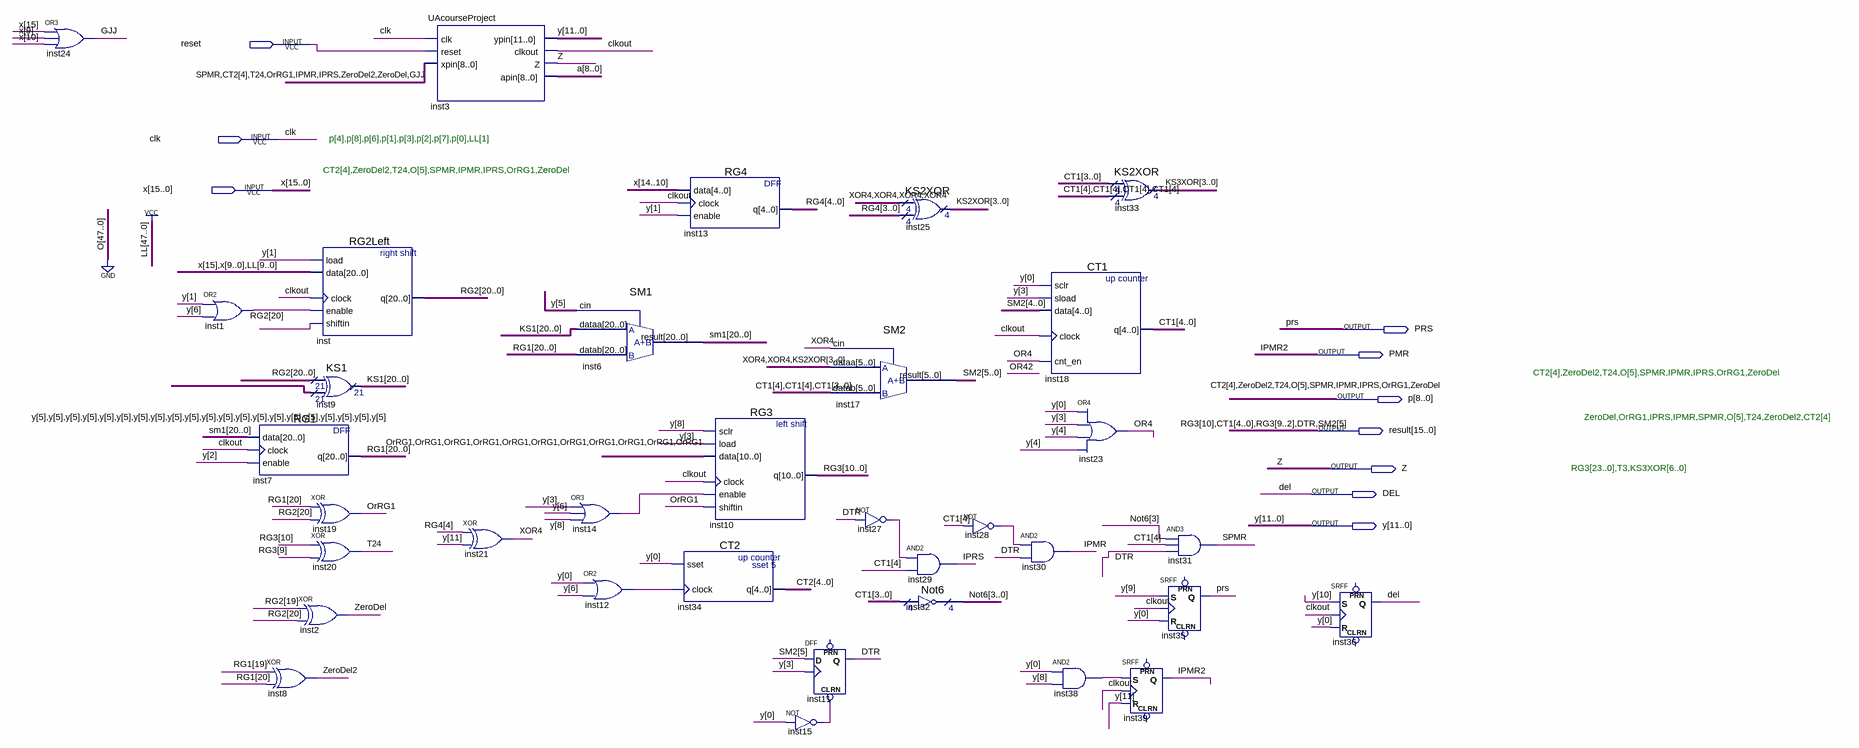
[diagram p0: schematic sheet]
// Quartus schematic courseProject.bdf as structural Verilog: 34 symbols, 10 pins
module courseProject (
  input  reset,
  input  clk,
  input  [15:0] x,
  output PRS,
  output PMR,
  output [8:0] p,
  output [15:0] result,
  output Z,
  output DEL,
  output [11:0] y
);

  wire clkout, GJJ, inst1_out, inst12_out, inst14_out, inst15_out, inst27_out, inst28_out, inst38_out, OR4,
       XOR4;
  wire [1:0] RG3;
  wire [3:0] CT2, KS2XOR, KS3XOR, Not6;
  wire [4:0] RG4, SM2;
  wire [8:0] a;
  wire [20:0] KS1, RG1, RG2, sm1;

  or inst24 (GJJ, x[15], x[9], x[10]);
  or inst1 (inst1_out, y[1], y[6]);
  RG1 inst7 (.data(sm1), .clock(clkout), .enable(y[2]), .q(RG1));
  RG2Left inst (
    .load(y[1]), .data({x[15], x[9:0], {10{1'b1}}}), .clock(clkout), .enable(inst1_out), .shiftin(RG2[20]),
    .q(RG2));
  KS1 inst9 (.data0x(RG2), .data1x({21{y[5]}}), .result(KS1));
  xor inst19 (p[1], RG1[20], RG2[20]);
  xor inst20 (p[6], result[15], result[9]);
  xor inst2 (p[0], RG2[19], RG2[20]);
  xor inst8 (p[7], RG1[19], RG1[20]);
  UAcourseProject inst3 (
    .clk(clk), .reset(reset), .xpin({p[4], p[8], p[6], p[1], p[3:2], p[7], p[0], GJJ}), .ypin(y),
    .clkout(clkout), .Z(Z), .apin(a));
  xor inst21 (XOR4, RG4[4], y[11]);
  SM1 inst6 (.dataa(KS1), .datab(RG1), .cin(y[5]), .result(sm1));
  or inst14 (inst14_out, y[3], y[6], y[8]);
  or inst12 (inst12_out, y[0], y[6]);
  RG4 inst13 (.data(x[14:10]), .clock(clkout), .enable(y[1]), .q(RG4));
  RG3 inst10 (
    .sclr(y[8]), .load(y[3]), .data({11{p[1]}}), .clock(clkout), .enable(inst14_out), .shiftin(p[1]),
    .q({result[15], result[9:2], RG3}));
  CT2 inst34 (.sset(y[0]), .clock(inst12_out), .q({p[8], CT2}));
  DFF inst11 (.CLRN(inst15_out), .CLK(y[3]), .D(result[0]), .Q(result[1]));  // open: PRN
  not inst15 (inst15_out, y[0]);
  SM2 inst17 (
    .dataa({{2{XOR4}}, KS2XOR}), .datab({{2{result[14]}}, result[13:10]}), .cin(XOR4),
    .result({result[0], SM2}));
  not inst27 (inst27_out, result[1]);
  KS2XOR inst25 (.data0x({4{XOR4}}), .data1x(RG4[3:0]), .result(KS2XOR));
  and inst29 (p[2], inst27_out, result[14]);
  Not6 inst32 (.data(result[13:10]), .result(Not6));
  not inst28 (inst28_out, result[14]);
  and inst30 (p[3], inst28_out, result[1]);
  CT1 inst18 (.sclr(y[0]), .sload(y[3]), .data(SM2), .clock(clkout), .cnt_en(OR4), .q(result[14:10]));
  and inst38 (inst38_out, y[0], y[8]);
  KS2XOR inst33 (.data0x(result[13:10]), .data1x({4{result[14]}}), .result(KS3XOR));
  or inst23 (OR4, y[0], y[3], y[4], y[4]);
  SRFF inst39 (.S(inst38_out), .R(y[11]), .CLK(clkout), .Q(PMR));  // open: PRN, CLRN
  and inst31 (p[4], Not6[3], result[14], result[1]);
  SRFF inst35 (.S(y[9]), .R(y[0]), .CLK(clkout), .Q(PRS));  // open: PRN, CLRN
  SRFF inst36 (.S(y[10]), .R(y[0]), .CLK(clkout), .Q(DEL));  // open: PRN, CLRN

  assign p[5] = 1'b0;

  // Other names for the same wires on the sheet: CT1[4:0] = result[14:10]; CT2[4] = p[8]; DTR = result[1];
  //   IPMR = p[3]; IPMR2 = PMR; IPRS = p[2]; OrRG1 = p[1]; RG3[10:2] = {result[15], result[9:2]}; SM2[5] = result[0];
  //   SPMR = p[4]; T24 = p[6]; ZeroDel = p[0]; ZeroDel2 = p[7]

  // Notes on the sheet:
  //   p[4],p[8],p[6],p[1],p[3],p[2],p[7],p[0],LL[1]
  //   CT2[4],ZeroDel2,T24,O[5],SPMR,IPMR,IPRS,OrRG1,ZeroDel
  //   CT2[4],ZeroDel2,T24,O[5],SPMR,IPMR,IPRS,OrRG1,ZeroDel
  //   ZeroDel,OrRG1,IPRS,IPMR,SPMR,O[5],T24,ZeroDel2,CT2[4]
  //   RG3[23..0],T3,KS3XOR[6..0]
endmodule
